# Altium schematic sheet DSP_FPGA.SchDoc
size A4
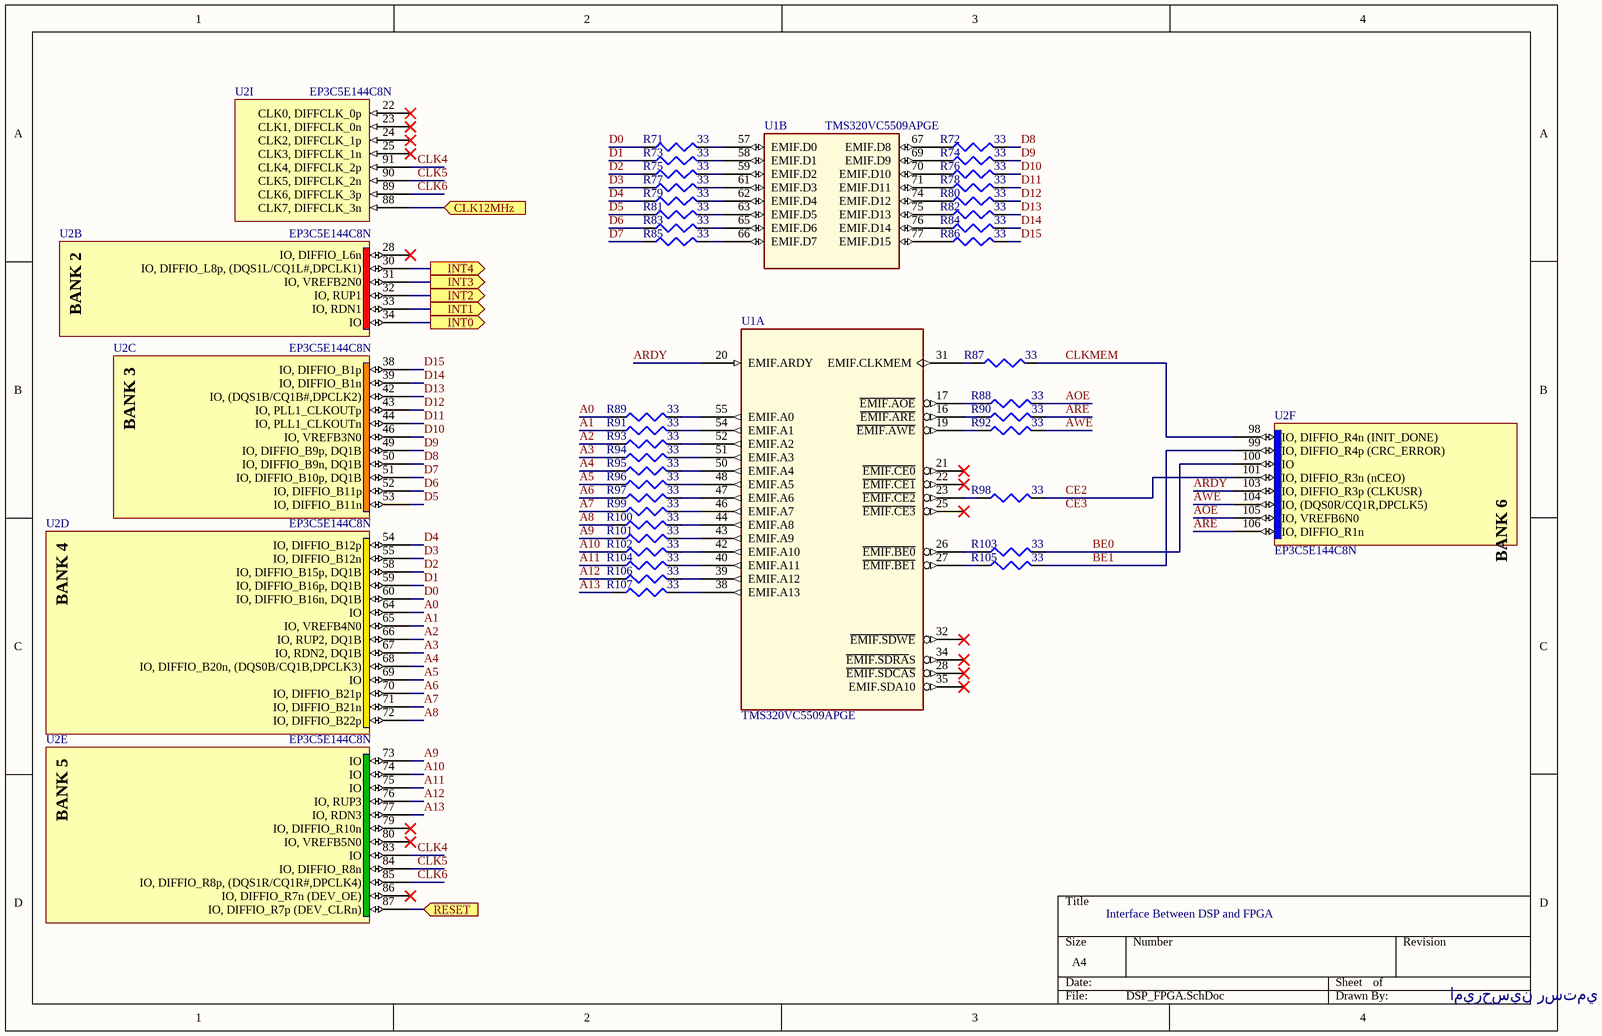
[diagram p0: DSP_FPGA.SchDoc]

## Parts
R71  33  [J1-0603]
R72  33  [J1-0603]
R73  33  [J1-0603]
R74  33  [J1-0603]
R75  33  [J1-0603]
R76  33  [J1-0603]
R77  33  [J1-0603]
R78  33  [J1-0603]
R79  33  [J1-0603]
R80  33  [J1-0603]
R81  33  [J1-0603]
R82  33  [J1-0603]
R83  33  [J1-0603]
R84  33  [J1-0603]
R85  33  [J1-0603]
R86  33  [J1-0603]
R87  33  [J1-0603]
R88  33  [J1-0603]
R89  33  [J1-0603]
R90  33  [J1-0603]
R91  33  [J1-0603]
R92  33  [J1-0603]
R93  33  [J1-0603]
R94  33  [J1-0603]
R95  33  [J1-0603]
R96  33  [J1-0603]
R97  33  [J1-0603]
R98  33  [J1-0603]
R99  33  [J1-0603]
R100  33  [J1-0603]
R101  33  [J1-0603]
R102  33  [J1-0603]
R103  33  [J1-0603]
R104  33  [J1-0603]
R105  33  [J1-0603]
R106  33  [J1-0603]
R107  33  [J1-0603]
U1  TMS320VC5509APGE  [TMSVC5509APGA]  (parts A,B of 16)
U2  EP3C5E144C8N  [EQFP144_N]  (parts B,C,D,E,F,I of 13)

## Ports
CLK12MHz (in), INT0 (out), INT1 (out), INT2 (out), INT3 (out), INT4 (out), RESET (in)

## Nets
A0: R89.2 U2.64(IO)
A1: R91.2 U2.65(IO,_VREFB4N0)
A2: R93.2 U2.66(IO,_RUP2,_DQ1B)
A3: R94.2 U2.67(IO,_RDN2,_DQ1B)
A4: R95.2 U2.68(IO,_DIFFIO_B20n,_(DQS0B/CQ1B,DPCLK3))
A5: R96.2 U2.69(IO)
A6: R97.2 U2.70(IO,_DIFFIO_B21p)
A7: R99.2 U2.71(IO,_DIFFIO_B21n)
A8: R100.2 U2.72(IO,_DIFFIO_B22p)
A9: R101.2 U2.73(IO)
A10: R102.2 U2.74(IO)
A11: R104.2 U2.75(IO)
A12: R106.2 U2.76(IO,_RUP3)
A13: R107.2 U2.77(IO,_RDN3)
AOE: R88.1 U2.105(IO,_VREFB6N0)
ARDY: U1.20(EMIF.ARDY) U2.103(IO,_DIFFIO_R3p_(CLKUSR))
ARE: R90.1 U2.106(IO,_DIFFIO_R1n)
AWE: R92.1 U2.104(IO,_(DQS0R/CQ1R,DPCLK5))
BE0: R103.1 U2.100(IO)
BE1: R105.1 U2.99(IO,_DIFFIO_R4p_(CRC_ERROR))
CE2: R98.1 U2.101(IO,_DIFFIO_R3n_(nCEO))
CLK4: U2.83(IO) U2.91(CLK4,_DIFFCLK_2p)
CLK5: U2.84(IO,_DIFFIO_R8n) U2.90(CLK5,_DIFFCLK_2n)
CLK6: U2.85(IO,_DIFFIO_R8p,_(DQS1R/CQ1R#,DPCLK4)) U2.89(CLK6,_DIFFCLK_3p)
CLK12MHz: U2.88(CLK7,_DIFFCLK_3n) ; port CLK12MHz
CLKMEM: R87.1 U2.98(IO,_DIFFIO_R4n_(INIT_DONE))
D0: R71.1 U2.60(IO,_DIFFIO_B16n,_DQ1B)
D1: R73.1 U2.59(IO,_DIFFIO_B16p,_DQ1B)
D2: R75.1 U2.58(IO,_DIFFIO_B15p,_DQ1B)
D3: R77.1 U2.55(IO,_DIFFIO_B12n)
D4: R79.1 U2.54(IO,_DIFFIO_B12p)
D5: R81.1 U2.53(IO,_DIFFIO_B11n)
D6: R83.1 U2.52(IO,_DIFFIO_B11p)
D7: R85.1 U2.51(IO,_DIFFIO_B10p,_DQ1B)
D8: R72.2 U2.50(IO,_DIFFIO_B9n,_DQ1B)
D9: R74.2 U2.49(IO,_DIFFIO_B9p,_DQ1B)
D10: R76.2 U2.46(IO,_VREFB3N0)
D11: R78.2 U2.44(IO,_PLL1_CLKOUTn)
D12: R80.2 U2.43(IO,_PLL1_CLKOUTp)
D13: R82.2 U2.42(IO,_(DQS1B/CQ1B#,DPCLK2))
D14: R84.2 U2.39(IO,_DIFFIO_B1n)
D15: R86.2 U2.38(IO,_DIFFIO_B1p)
INT0: U2.34(IO) ; port INT0
INT1: U2.33(IO,_RDN1) ; port INT1
INT2: U2.32(IO,_RUP1) ; port INT2
INT3: U2.31(IO,_VREFB2N0) ; port INT3
INT4: U2.30(IO,_DIFFIO_L8p,_(DQS1L/CQ1L#,DPCLK1)) ; port INT4
RESET: U2.87(IO,_DIFFIO_R7p_(DEV_CLRn)) ; port RESET
NetR71_2: R71.2 U1.57(EMIF.D0)
NetR72_1: R72.1 U1.67(EMIF.D8)
NetR73_2: R73.2 U1.58(EMIF.D1)
NetR74_1: R74.1 U1.69(EMIF.D9)
NetR75_2: R75.2 U1.59(EMIF.D2)
NetR76_1: R76.1 U1.70(EMIF.D10)
NetR77_2: R77.2 U1.61(EMIF.D3)
NetR78_1: R78.1 U1.71(EMIF.D11)
NetR79_2: R79.2 U1.62(EMIF.D4)
NetR80_1: R80.1 U1.74(EMIF.D12)
NetR81_2: R81.2 U1.63(EMIF.D5)
NetR82_1: R82.1 U1.75(EMIF.D13)
NetR83_2: R83.2 U1.65(EMIF.D6)
NetR84_1: R84.1 U1.76(EMIF.D14)
NetR85_2: R85.2 U1.66(EMIF.D7)
NetR86_1: R86.1 U1.77(EMIF.D15)
NetR87_2: R87.2 U1.31(EMIF.CLKMEM)
NetR88_2: R88.2 U1.17(~{EMIF.AOE})
NetR89_1: R89.1 U1.55(EMIF.A0)
NetR90_2: R90.2 U1.16(~{EMIF.ARE})
NetR91_1: R91.1 U1.54(EMIF.A1)
NetR92_2: R92.2 U1.19(~{EMIF.AWE})
NetR93_1: R93.1 U1.52(EMIF.A2)
NetR94_1: R94.1 U1.51(EMIF.A3)
NetR95_1: R95.1 U1.50(EMIF.A4)
NetR96_1: R96.1 U1.48(EMIF.A5)
NetR97_1: R97.1 U1.47(EMIF.A6)
NetR98_2: R98.2 U1.23(~{EMIF.CE2})
NetR99_1: R99.1 U1.46(EMIF.A7)
NetR100_1: R100.1 U1.44(EMIF.A8)
NetR101_1: R101.1 U1.43(EMIF.A9)
NetR102_1: R102.1 U1.42(EMIF.A10)
NetR103_2: R103.2 U1.26(~{EMIF.BE0})
NetR104_1: R104.1 U1.40(EMIF.A11)
NetR105_2: R105.2 U1.27(~{EMIF.BE1})
NetR106_1: R106.1 U1.39(EMIF.A12)
NetR107_1: R107.1 U1.38(EMIF.A13)

Not connected (* = marked no-connect by the designer): U1 21(~{EMIF.CE0})* 22(~{EMIF.CE1})* 25(~{EMIF.CE3})* 28(~{EMIF.SDCAS})* 32(~{EMIF.SDWE})* 34(~{EMIF.SDRA}S)* 35(EMIF.SDA10)*; U2 22(CLK0,_DIFFCLK_0p)* 23(CLK1,_DIFFCLK_0n)* 24(CLK2,_DIFFCLK_1p)* 25(CLK3,_DIFFCLK_1n)* 28(IO,_DIFFIO_L6n)* 79(IO,_DIFFIO_R10n)* 80(IO,_VREFB5N0)* 86(IO,_DIFFIO_R7n_(DEV_OE))*

## Notes on the sheet
- Interface Between DSP and FPGA
- اميرحسين رستمي
- Labels drawn without touching a wire or pin: CE3
- (in symbol EP3C5E144C8N, part B) BANK 2
- (in symbol EP3C5E144C8N, part C) BANK 3
- (in symbol EP3C5E144C8N, part D) BANK 4
- (in symbol EP3C5E144C8N, part E) BANK 5
- (in symbol EP3C5E144C8N, part F) BANK 6

## Library data of the parts
R71-R107 = Res3: Resistor; Published: 8-Jun-2000; LatestRevisionDate: 04-Mar-2005; LatestRevisionNote: PCB Footprint replaced.; PackageReference: J1-0603; Publisher: Altium Limited; Value: 33
U2 = EP3C5E144C8N: Cyclone III Family FPGA, 94 I/O Pins, 4 PLLs, 144-Pin EQFP, Speed Grade 8, Commercial Grade, Pb-Free; Note: Exposed pad at the bottom of this package must be connected to PCB GND.; Published: 14-Mar-2008; LatestRevisionDate: 27-Jun-2008; LatestRevisionNote: Sch pin for exposed pad added.; DatasheetVersion: ver2.0, May-2008; PackageVersion: ver15.1, May-2008; PackageReference: EQFP144; Publisher: Altium Limited; PackageDescription: 144-Pin Plastic Enhanced Quad Flat Pack (EQFP144) - Wire Bond; Code_JEDEC: MS-026-BFB; ComponentLink1Description: Manufacturer Link; ComponentLink1URL: http://www.altera.com/; ComponentLink2Description: Handbook (7.86MB); ComponentLink2URL: http://www.altera.com/literature/hb/cyc3/cyclone3_handbook.pdf; ComponentLink3Description: Packaging Specification; ComponentLink3URL: http://www.altera.com/literature/ds/dspkg.pdf